# Altium project SynthyTwo.Project.PrjPcb
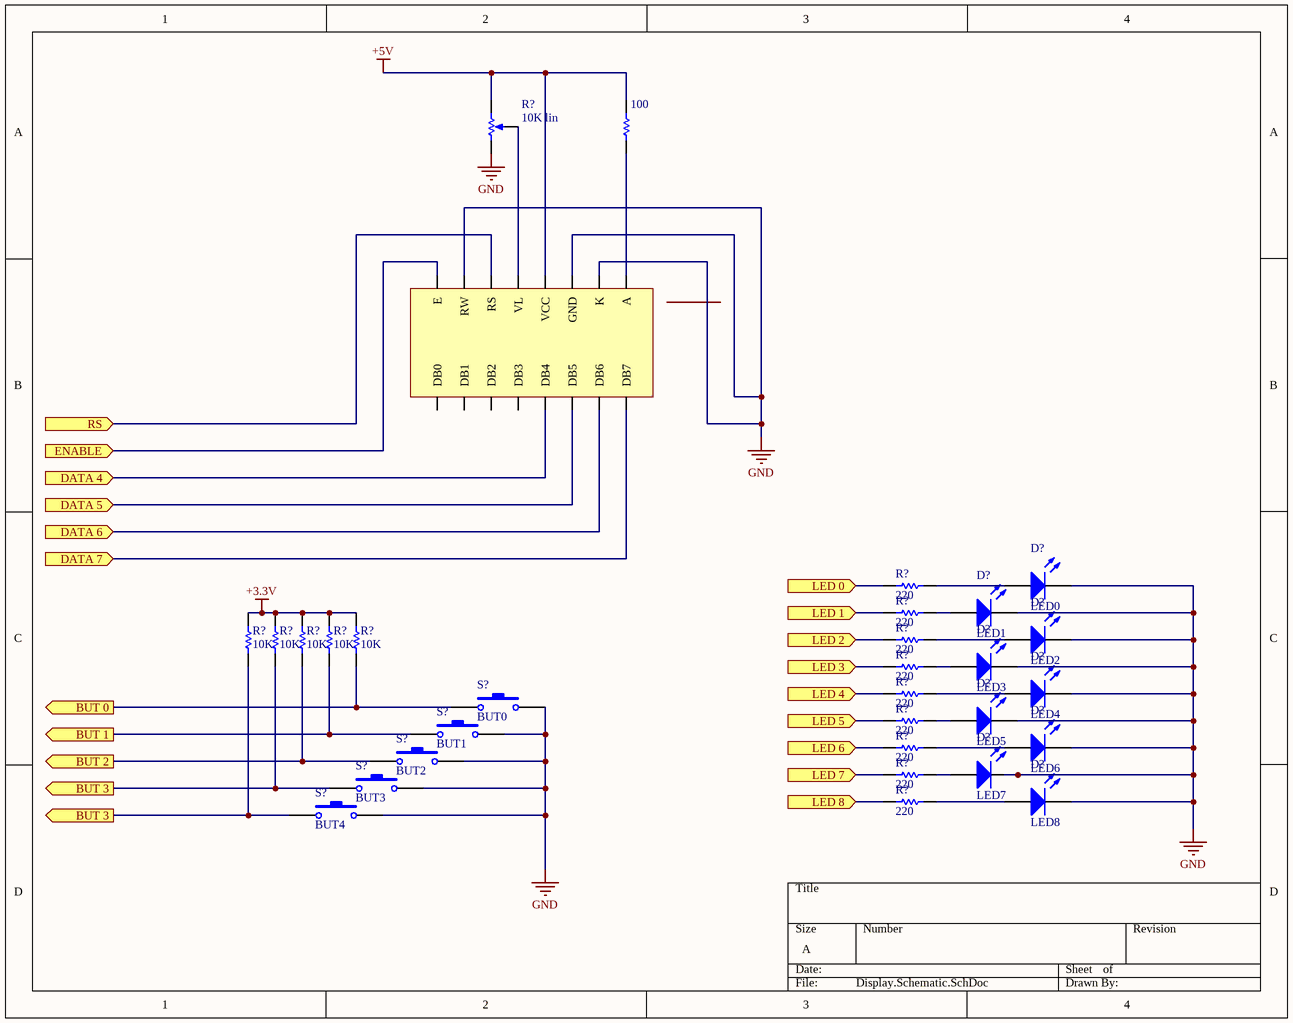
[diagram p0: Display.Schematic.SchDoc]
6 sheets, 156 parts. Net scope: flat (ports and power ports of the same name join across sheets).
Sheets:
  Display.Schematic.SchDoc
  FilterBoard.Schematic.SchDoc
  PSU.Schematic.SchDoc
  PIC.Schematic.SchDoc
  DAC.Schematic.SchDoc
  MIDI.Schematic.SchDoc

## Sheet Display.Schematic.SchDoc
size A

### Parts
(Parts that share a designator on the sheet are numbered #1, #2 ... from top to bottom, then left to right.)
*  16x2 LCD  (value not drawn)
D?#1  LED0  [LED-0]
D?#2  LED1  [LED-0]
D?#3  LED2  [LED-0]
D?#4  LED3  [LED-0]
D?#5  LED4  [LED-0]
D?#6  LED5  [LED-0]
D?#7  LED6  [LED-0]
D?#8  LED7  [LED-0]
D?#9  LED8  [LED-0]
R?#1  10K lin  [VR5]
R?#2  100  [AXIAL-0.3]
R?#3  220  [AXIAL-0.3]
R?#4  220  [AXIAL-0.3]
R?#5  220  [AXIAL-0.3]
R?#6  10K  [AXIAL-0.3]
R?#7  10K  [AXIAL-0.3]
R?#8  10K  [AXIAL-0.3]
R?#9  10K  [AXIAL-0.3]
R?#10  10K  [AXIAL-0.3]
R?#11  220  [AXIAL-0.3]
R?#12  220  [AXIAL-0.3]
R?#13  220  [AXIAL-0.3]
R?#14  220  [AXIAL-0.3]
R?#15  220  [AXIAL-0.3]
R?#16  220  [AXIAL-0.3]
S?#1  BUT0  [SPST-2]
S?#2  BUT1  [SPST-2]
S?#3  BUT2  [SPST-2]
S?#4  BUT3  [SPST-2]
S?#5  BUT4  [SPST-2]

### Ports
BUT 0 (out), BUT 1 (out), BUT 2 (out), BUT 3 (out), DATA 4 (in), DATA 5 (in), DATA 6 (in), DATA 7 (in), ENABLE (in), LED 0 (in), LED 1 (in), LED 2 (in), LED 3 (in), LED 4 (in), LED 5 (in), LED 6 (in), LED 7 (in), LED 8 (in), RS (in)

### Nets
+3.3V: R?#6.2 R?#7.2 R?#8.2 R?#9.2 R?#10.2
+5V: *.2(VCC) R?#1.2(BOT) R?#2.2
GND: *.1(GND) *.5(RW) *.16(K) D?#1.2(K) D?#2.2(K) D?#3.2(K) D?#4.2(K) D?#5.2(K) D?#6.2(K) D?#7.2(K) D?#8.2(K) D?#9.2(K) R?#1.1(TOP) S?#1.2 S?#2.2 S?#3.2 S?#4.2 S?#5.2
Net*_3: *.3(VL) R?#1.3(TAP)
Net*_4: *.4(RS) ; port RS
Net*_6: *.6(E) ; port ENABLE
Net*_7: *.7(DB7) ; port DATA 7
Net*_8: *.8(DB6) ; port DATA 6
Net*_9: *.9(DB5) ; port DATA 5
Net*_10: *.10(DB4) ; port DATA 4
Net*_15: *.15(A) R?#2.1
NetD?#1_1: D?#1.1(A) R?#3.2
NetD?#2_1: D?#2.1(A) R?#4.2
NetD?#3_1: D?#3.1(A) R?#5.2
NetD?#4_1: D?#4.1(A) R?#11.2
NetD?#5_1: D?#5.1(A) R?#12.2
NetD?#6_1: D?#6.1(A) R?#13.2
NetD?#7_1: D?#7.1(A) R?#14.2
NetD?#8_1: D?#8.1(A) R?#15.2
NetD?#9_1: D?#9.1(A) R?#16.2
NetR?#3_1: R?#3.1 ; port LED 0
NetR?#4_1: R?#4.1 ; port LED 1
NetR?#5_1: R?#5.1 ; port LED 2
NetR?#6_1: R?#6.1 R?#7.1 S?#4.1 S?#5.1 ; port BUT 3
NetR?#8_1: R?#8.1 S?#3.1 ; port BUT 2
NetR?#9_1: R?#9.1 S?#2.1 ; port BUT 1
NetR?#10_1: R?#10.1 S?#1.1 ; port BUT 0
NetR?#11_1: R?#11.1 ; port LED 3
NetR?#12_1: R?#12.1 ; port LED 4
NetR?#13_1: R?#13.1 ; port LED 5
NetR?#14_1: R?#14.1 ; port LED 6
NetR?#15_1: R?#15.1 ; port LED 7
NetR?#16_1: R?#16.1 ; port LED 8

Not connected (* = marked no-connect by the designer): * 11(DB3) 12(DB2) 13(DB1) 14(DB0)

### Library data of the parts
* = Display
D?#1-D?#9 = LED0: Typical INFRARED GaAs LED; Published: 8-Jun-2000; LatestRevisionDate: 08-Jul-2005; LatestRevisionNote: Mech Layer 1 removed.; PackageReference: LED-0; Publisher: Altium Limited; PackageDescription: LED; 2 Leads
R?#1 = RPot: Potentiometer; Sim Note: Enter the Resistance value and the set point into parameter fields.; Set Position: 0.5; Published: 8-Jun-2000; LatestRevisionDate: 17-Jul-2002; LatestRevisionNote: Re-released for DXP Platform.; PackageReference: VR5; Publisher: Altium Limited; PackageDescription: Variable Resistor, Thru-Hole; 3 Leads; Value: 10K
R?#2-R?#4 R?#6-R?#10 = Res1: Resistor; Value: 1K; Published: 8-Jun-2000; LatestRevisionDate: 17-Jul-2002; LatestRevisionNote: Re-released for DXP Platform.; PackageReference: AXIAL-0.3; Publisher: Altium Limited; PackageDescription: Axial Device, Thru-Hole; 2 Leads; 0.3 in Pin Spacing
R?#5 R?#11-R?#16 = Res1: Resistor; Published: 8-Jun-2000; LatestRevisionDate: 17-Jul-2002; LatestRevisionNote: Re-released for DXP Platform.; PackageReference: AXIAL-0.3; Publisher: Altium Limited; PackageDescription: Axial Device, Thru-Hole; 2 Leads; 0.3 in Pin Spacing; Value: 220
S?#1-S?#5 = SW-PB: Switch; Published: 24-Mar-1999; LatestRevisionDate: 17-Jul-2002; LatestRevisionNote: Re-released for DXP Platform.; PackageReference: SPST-2; Publisher: Altium Limited; PackageDescription: Switch; 2 Leads

## Sheet FilterBoard.Schematic.SchDoc
size B
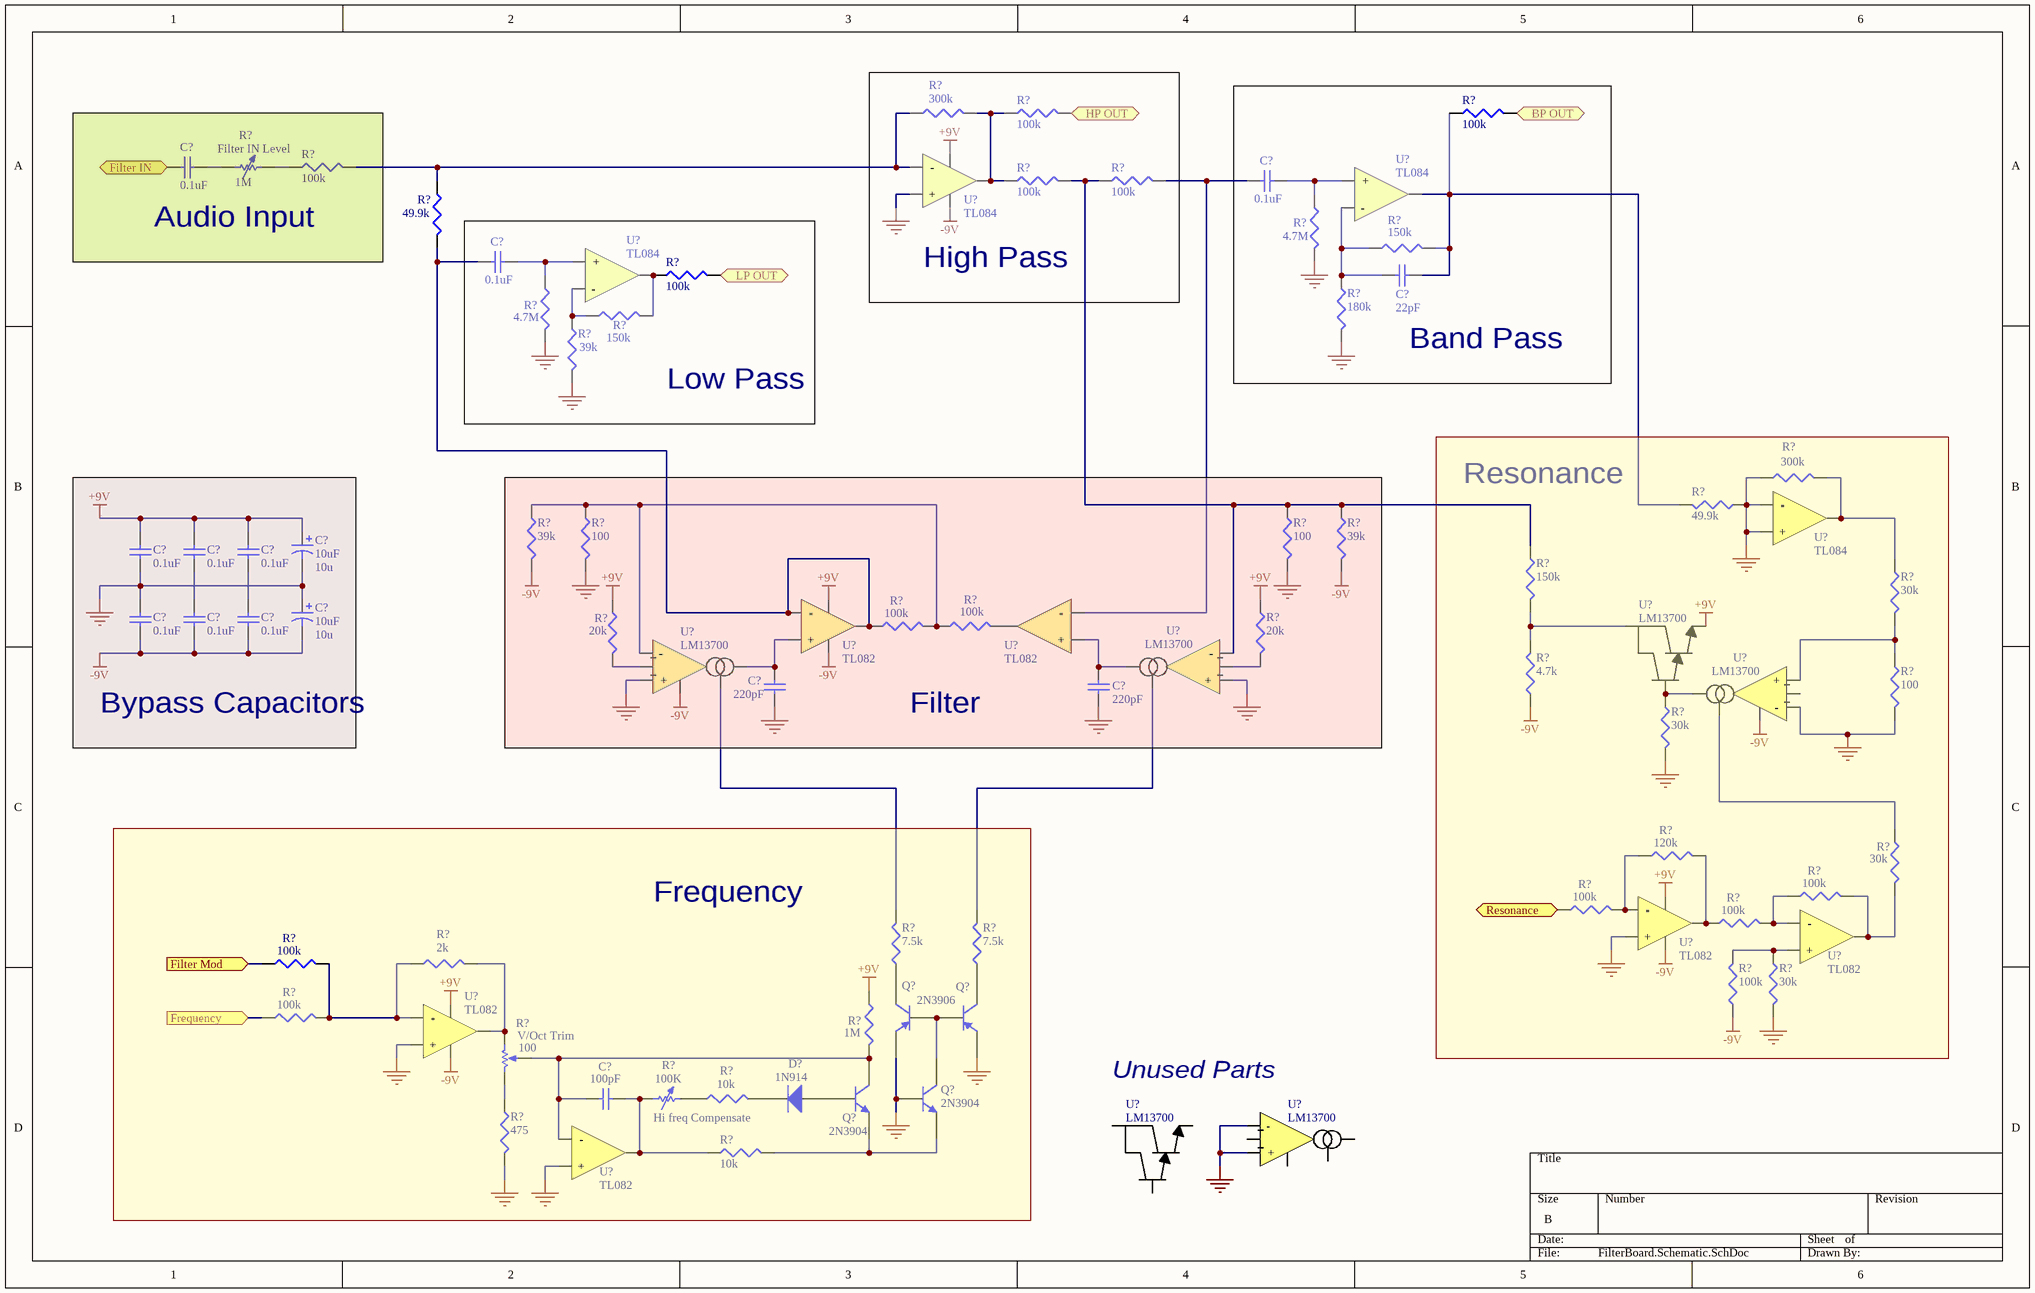
[diagram p1: FilterBoard.Schematic.SchDoc]

### Parts
(Parts that share a designator on the sheet are numbered #1, #2 ... from top to bottom, then left to right.)
C?#1  0.1uF  [C1206]
C?#2  0.1uF  [C1206]
C?#3  0.1uF  [C1206]
C?#4  22pF  [C1206]
C?#5  10uF  value 10u  [RB7.6-15]
C?#6  0.1uF  [C1206]
C?#7  0.1uF  [C1206]
C?#8  0.1uF  [C1206]
C?#9  10uF  value 10u  [RB7.6-15]
C?#10  0.1uF  [C1206]
C?#11  0.1uF  [C1206]
C?#12  0.1uF  [C1206]
C?#13  220pF  [C1206]
C?#14  220pF  [C1206]
C?#15  100pF  [C1206]
D?#10  1N914  [DO-41]
Q?#1  2N3906  [TO-92A]
Q?#2  2N3906  [TO-92A]  (value not drawn)
Q?#3  2N3904  [TO-92A]
Q?#4  2N3904  [TO-92A]
R?#17  300k  [J1-0603]
R?#18  100k  [J1-0603]
R?#19  100k  [J1-0603]
R?#20  Filter IN Level  value 1M  [AXIAL-0.7]
R?#21  100k  [J1-0603]
R?#22  100k  [J1-0603]
R?#23  100k  [J1-0603]
R?#24  49.9k  [J1-0603]
R?#25  4.7M  [J1-0603]
R?#26  150k  [J1-0603]
R?#27  100k  [J1-0603]
R?#28  4.7M  [J1-0603]
R?#29  180k  [J1-0603]
R?#30  150k  [J1-0603]
R?#31  39k  [J1-0603]
R?#32  300k  [J1-0603]
R?#33  39k  [J1-0603]
R?#34  100  [J1-0603]
R?#35  100  [J1-0603]
R?#36  39k  [J1-0603]
R?#37  49.9k  [J1-0603]
R?#38  150k  [J1-0603]
R?#39  30k  [J1-0603]
R?#40  20k  [J1-0603]
R?#41  100k  [J1-0603]
R?#42  100k  [J1-0603]
R?#43  20k  [J1-0603]
R?#44  100  [J1-0603]
R?#45  4.7k  [J1-0603]
R?#46  30k  [J1-0603]
R?#47  120k  [J1-0603]
R?#48  30k  [J1-0603]
R?#49  100k  [J1-0603]
R?#50  100k  [J1-0603]
R?#51  100k  [J1-0603]
R?#52  100k  [J1-0603]
R?#53  2k  [J1-0603]
R?#54  7.5k  [J1-0603]
R?#55  7.5k  [J1-0603]
R?#56  30k  [J1-0603]
R?#57  100k  [J1-0603]
R?#58  1M  [J1-0603]
R?#59  100k  [J1-0603]
R?#60  V/Oct Trim  value 100  [VR5]
R?#61  Hi freq Compensate  value 100K  [AXIAL-0.7]
R?#62  10k  [J1-0603]
R?#63  475  [J1-0603]
R?#64  10k  [J1-0603]
U?#1  TL084
U?#2  TL084
U?#3  TL084
U?#4  TL084
U?#5  TL082
U?#6  TL082
U?#7  LM13700
U?#8  LM13700
U?#9  LM13700
U?#10  LM13700
U?#11  TL082
U?#12  TL082
U?#13  TL082
U?#14  LM13700
U?#15  TL082
U?#16  LM13700

### Blocks framed on the sheet
Audio Input: C?#1 R?#20 R?#21
High Pass: R?#17 R?#18 R?#22 R?#23 U?#1
Band Pass: C?#2 C?#4 R?#19 R?#25 R?#26 R?#29 U?#2
Low Pass: C?#3 R?#27 R?#28 R?#30 R?#31 U?#3
Resonance: R?#32 R?#37-R?#39 R?#44-R?#51 R?#56 R?#59 U?#4 U?#9-U?#12
Bypass Capacitors: C?#5-C?#12
Filter: C?#13 C?#14 R?#33-R?#36 R?#40-R?#43 U?#5-U?#8
Frequency: C?#15 D?#10 Q?#1-Q?#4 R?#52-R?#55 R?#57 R?#58 R?#60-R?#64 U?#13 U?#15

### Ports
BP OUT (out), Filter IN (in), Filter Mod (in), Frequency (in), HP OUT (out), LP OUT (out), Resonance (in)

### Nets
+9V: C?#5.1 C?#6.2 C?#7.2 C?#8.2 R?#40.1 R?#43.1 R?#58.1 U?#1.4(VCC+) U?#5.8(VCC+) U?#9.8(BOUT) U?#11.8(VCC+) U?#13.8(VCC+)
-9V: C?#9.2 C?#10.1 C?#11.1 C?#12.1 R?#33.2 R?#36.2 R?#45.1 R?#59.1 U?#1.11(VCC-) U?#5.4(VCC-) U?#7.6(VCC-) U?#10.6(VCC-) U?#11.4(VCC-) U?#13.4(VCC-)
GND: C?#5.2 C?#6.1 C?#9.1 C?#10.2 C?#13.1 C?#14.1 Q?#1.1(E) Q?#2.1(E) Q?#4.2(B) R?#25.2 R?#28.2 R?#29.2 R?#31.2 R?#32.1 R?#34.2 R?#35.2 R?#37.1 R?#44.2 R?#46.2 R?#56.2 R?#63.2 U?#1.3(+) U?#4.12(-) U?#4.13(+) U?#7.3(+) U?#8.3(+) U?#10.3(-) U?#11.3(+) U?#13.3(+) U?#14.3(+) U?#14.4(-) U?#15.5(+)
NetC?#1_1: C?#1.1 ; port Filter IN
NetC?#1_2: C?#1.2 R?#20.1
NetC?#2_1: C?#2.1 R?#23.2 U?#6.6(-)
NetC?#2_2: C?#2.2 R?#25.1 U?#2.5(+)
NetC?#3_1: C?#3.1 R?#24.2 R?#41.1 U?#5.1(OUT) U?#5.2(-)
NetC?#3_2: C?#3.2 R?#28.1 U?#3.5(+)
NetC?#4_1: C?#4.1 R?#26.1 R?#29.1 U?#2.3(-)
NetC?#4_2: C?#4.2 R?#19.1 R?#26.2 R?#37.2 U?#2.7(OUT)
NetC?#7_1: C?#7.1 C?#11.2
NetC?#8_1: C?#8.1 C?#12.2
NetC?#13_2: C?#13.2 U?#5.3(+) U?#7.5(OUT)
NetC?#14_2: C?#14.2 U?#6.5(+) U?#8.5(OUT)
NetC?#15_1: C?#15.1 Q?#3.3(C) R?#58.2 R?#60.3(TAP) U?#15.6(-)
NetC?#15_2: C?#15.2 R?#61.1 R?#64.1 U?#15.7(OUT)
NetD?#10_1: D?#10.1(A) Q?#3.2(B)
NetD?#10_2: D?#10.2(K) R?#62.2
NetQ?#1_2: Q?#1.2(B) Q?#2.2(B) Q?#4.3(C)
NetQ?#1_3: Q?#1.3(C) R?#54.1
NetQ?#2_3: Q?#2.3(C) R?#55.1
NetQ?#3_1: Q?#3.1(E) Q?#4.1(E) R?#64.2
NetR?#17_1: R?#17.1 R?#21.2 R?#24.1 U?#1.2(-)
NetR?#17_2: R?#17.2 R?#18.1 R?#22.1 U?#1.1(OUT)
NetR?#18_2: R?#18.2 ; port HP OUT
NetR?#19_2: R?#19.2 ; port BP OUT
NetR?#20_2: R?#20.2 R?#21.1
NetR?#22_2: R?#22.2 R?#23.1 R?#35.1 R?#36.1 R?#38.1 U?#8.4(-)
NetR?#27_1: R?#27.1 R?#30.2 U?#3.7(OUT)
NetR?#27_2: R?#27.2 ; port LP OUT
NetR?#30_1: R?#30.1 R?#31.1 U?#3.3(-)
NetR?#32_2: R?#32.2 R?#39.1 U?#4.14(OUT)
NetR?#33_1: R?#33.1 R?#34.1 R?#41.2 R?#42.1 U?#7.4(-)
NetR?#38_2: R?#38.2 R?#45.2 U?#9.11(V+)
NetR?#39_2: R?#39.2 R?#44.1 U?#10.4(+)
NetR?#40_2: R?#40.2 U?#7.2
NetR?#42_2: R?#42.2 U?#6.7(OUT)
NetR?#43_2: R?#43.2 U?#8.2
NetR?#46_1: R?#46.1 U?#9.7(BIN) U?#10.5(OUT)
NetR?#47_1: R?#47.1 R?#50.2 U?#11.2(-)
NetR?#47_2: R?#47.2 R?#51.1 U?#11.1(OUT)
NetR?#48_1: R?#48.1 U?#10.1(BIAS)
NetR?#48_2: R?#48.2 R?#49.2 U?#12.7(OUT)
NetR?#49_1: R?#49.1 R?#51.2 U?#12.6(-)
NetR?#50_1: R?#50.1 ; port Resonance
NetR?#52_1: R?#52.1 ; port Filter Mod
NetR?#52_2: R?#52.2 R?#53.1 R?#57.2 U?#13.2(-)
NetR?#53_2: R?#53.2 R?#60.1(TOP) U?#13.1(OUT)
NetR?#54_2: R?#54.2 U?#7.1(BIAS)
NetR?#55_2: R?#55.2 U?#8.1(BIAS)
NetR?#56_1: R?#56.1 R?#59.2 U?#12.5(+)
NetR?#57_1: R?#57.1 ; port Frequency
NetR?#60_2: R?#60.2(BOT) R?#63.1
NetR?#61_2: R?#61.2 R?#62.1

Not connected (* = marked no-connect by the designer): U?#2 6(VCC+) 11(VCC-); U?#3 6(VCC+) 11(VCC-); U?#4 1(VCC+) 11(VCC-); U?#6 4(VCC-) 8(VCC+); U?#8 6(VCC-); U?#10 2; U?#12 4(VCC-) 8(VCC+); U?#14 1(BIAS) 2 5(OUT) 6(VCC-); U?#15 4(VCC-) 8(VCC+); U?#16 7(BIN) 8(BOUT) 11(V+)

### Notes on the sheet
- (near U?#16) Unused Parts

### Library data of the parts
C?#1-C?#3 C?#6-C?#8 C?#10-C?#12 = Cap Semi: Capacitor (Semiconductor SIM Model); Value: 0.1u; Published: 8-Jun-2000; LatestRevisionDate: 29-May-2009; LatestRevisionNote: IPC-7351 Footprint Added.; PackageReference: C1206; Publisher: Altium Limited; PackageDescription: Chip Capacitor
C?#4 = Cap Semi: Capacitor (Semiconductor SIM Model); Value: 22p; Published: 8-Jun-2000; LatestRevisionDate: 29-May-2009; LatestRevisionNote: IPC-7351 Footprint Added.; PackageReference: C1206; Publisher: Altium Limited; PackageDescription: Chip Capacitor
C?#5 C?#9 = Cap Pol1: Polarized Capacitor (Radial); Published: 8-Jun-2000; LatestRevisionDate: 17-Jul-2002; LatestRevisionNote: Re-released for DXP Platform.; PackageReference: RB7.6-15; Publisher: Altium Limited; PackageDescription: Polarized Capacitor (Radial); 2 Leads
C?#13 C?#14 = Cap Semi: Capacitor (Semiconductor SIM Model); Value: 220p; Published: 8-Jun-2000; LatestRevisionDate: 29-May-2009; LatestRevisionNote: IPC-7351 Footprint Added.; PackageReference: C1206; Publisher: Altium Limited; PackageDescription: Chip Capacitor
C?#15 = Cap Semi: Capacitor (Semiconductor SIM Model); Value: 100p; Published: 8-Jun-2000; LatestRevisionDate: 29-May-2009; LatestRevisionNote: IPC-7351 Footprint Added.; PackageReference: C1206; Publisher: Altium Limited; PackageDescription: Chip Capacitor
D?#10 = Diode 1N4001: 1 Amp General Purpose Rectifier; Published: 8-Jun-2000; LatestRevisionDate: 17-Jul-2002; LatestRevisionNote: Re-released for DXP Platform.; DatasheetVersion: 1998; PackageVersion: Aug-1999; PackageReference: DO-41; Publisher: Altium Limited; PackageDescription: Diode, Axial; Body 5.2 x 2.7 mm (LxDia. max), Lead Dia. 0.86 mm (max); Code_JEDEC: DO-204-AL; ComponentLink1Description: Manufacturer Link; ComponentLink1URL: http://www.fairchildsemi.com/; ComponentLink2Description: Datasheet; ComponentLink2URL: http://www.fairchildsemi.com/ds/1N%2F1N4001.pdf
Q?#1 Q?#2 = 2N3906: PNP General Purpose Amplifier; Published: 8-Jun-2000; LatestRevisionDate: 15-Jan-2003; LatestRevisionNote: PCB Footprint 'BCY-W3/D4.7' replaced; DatasheetVersion: 1997; PackageVersion: Sep-1998; PackageReference: TO-92A; Publisher: Altium Limited; PackageDescription: TO, Flat Index; 3 In-Line, Axial Leads; Body Dia. 4.5mm; Leads 0.51 x 0.48 mm (max); ComponentLink1Description: Manufacturer Link; ComponentLink1URL: http://www.fairchildsemi.com/; ComponentLink2Description: Datasheet; ComponentLink2URL: http://www.fairchildsemi.com/ds/2N%2F2N3906.pdf
Q?#3 Q?#4 = 2N3904: NPN General Purpose Amplifier; Published: 8-Jun-2000; LatestRevisionDate: 15-Jan-2003; LatestRevisionNote: PCB Footprint 'BCY-W3/D4.7' replaced; DatasheetVersion: 1997; PackageVersion: Sep-1998; PackageReference: TO-92A; Publisher: Altium Limited; PackageDescription: TO, Flat Index; 3 In-Line, Axial Leads; Body Dia. 4.5mm; Leads 0.51 x 0.48 mm (max); ComponentLink1Description: Manufacturer Link; ComponentLink1URL: http://www.fairchildsemi.com/; ComponentLink2Description: Datasheet; ComponentLink2URL: http://www.fairchildsemi.com/ds/2N%2F2N3904.pdf
R?#17-R?#19 R?#21-R?#59 R?#62-R?#64 = Res3: Resistor; Published: 8-Jun-2000; LatestRevisionDate: 29-May-2009; LatestRevisionNote: IPC-7351 Footprint Added.; PackageReference: J1-0603; Publisher: Altium Limited; PackageDescription: Chip Resistor
  R?#17 R?#32: Value: 300K
  R?#18 R?#19 R?#21-R?#23 R?#27 R?#41 R?#42 R?#49-R?#52 R?#57 R?#59: Value: 100K
  R?#24 R?#37: Value: 49.9K
  R?#25 R?#28: Value: 4.7M
  R?#26 R?#30 R?#38: Value: 150K
  R?#29: Value: 180K
  R?#31 R?#33 R?#36: Value: 39K
  R?#34 R?#35 R?#44: Value: 100
  R?#39 R?#46 R?#48 R?#56: Value: 30K
  R?#40 R?#43: Value: 20K
  R?#45: Value: 4.7K
  R?#47: Value: 120K
  R?#53: Value: 2K
  R?#54 R?#55: Value: 7.5K
  R?#58: Value: 1M
  R?#62 R?#64: Value: 10K
  R?#63: Value: 475
R?#20 R?#61 = Res Adj1: Variable Resistor; Set Position: 0.5; Published: 8-Jun-2000; LatestRevisionDate: 17-Jul-2002; LatestRevisionNote: Re-released for DXP Platform.; PackageReference: AXIAL-0.7; Publisher: Altium Limited; PackageDescription: Axial Device, Thru-Hole; 2 Leads; 0.7 in Pin Spacing
R?#60 = RPot: as R?#1 on sheet Display.Schematic; Published: 8-Jun-2000; LatestRevisionDate: 17-Jul-2002; LatestRevisionNote: Re-released for DXP Platform.; PackageReference: VR5; Publisher: Altium Limited; PackageDescription: Variable Resistor, Thru-Hole; 3 Leads
U?#9 U?#16 = LM13700_1

## Sheet PSU.Schematic.SchDoc
size A
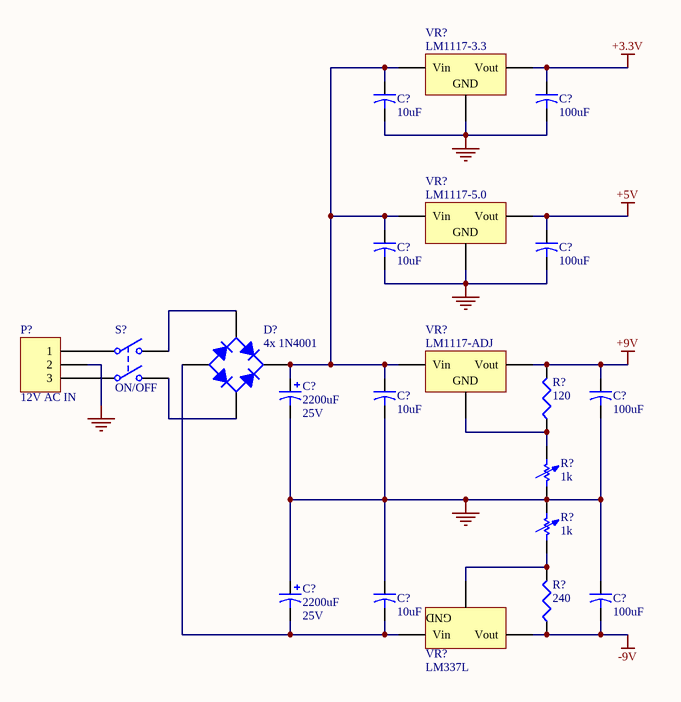
[diagram p2: PSU.Schematic.SchDoc]

### Parts
(Parts that share a designator on the sheet are numbered #1, #2 ... from top to bottom, then left to right.)
C?#16  10uF  [CAPR5-4X5]
C?#17  100uF  [CAPR5-4X5]
C?#18  10uF  [CAPR5-4X5]
C?#19  100uF  [CAPR5-4X5]
C?#20  2200uF  value 25V  [RB7.6-15]
C?#21  10uF  [CAPR5-4X5]
C?#22  100uF  [CAPR5-4X5]
C?#23  2200uF  value 25V  [RB7.6-15]
C?#24  10uF  [CAPR5-4X5]
C?#25  100uF  [CAPR5-4X5]
D?#11  4x 1N4001  [D-38]
P?  12V AC IN  [HDR1X3]
R?#65  120  [J1-0603]
R?#66  1k  [AXIAL-0.7]
R?#67  1k  [AXIAL-0.7]
R?#68  240  [J1-0603]
S?#6  ON/OFF  [DPST-4]
VR?#1  LM1117-3.3  [D2PAK_N]
VR?#2  LM1117-5.0  [D2PAK_N]
VR?#3  LM1117-ADJ  [D2PAK_N]
VR?#4  LM337L  [D2PAK_N]

### Nets
+3.3V: C?#17.1 VR?#1.3(Vout)
+5V: C?#19.1 VR?#2.3(Vout)
+9V: C?#22.1 R?#65.2 VR?#3.3(Vout)
-9V: C?#25.2 R?#68.1 VR?#4.3(Vout)
GND: C?#16.2 C?#17.2 C?#18.2 C?#19.2 C?#20.2 C?#21.2 C?#22.2 C?#23.1 C?#24.1 C?#25.1 P?.2 R?#66.1 R?#67.2 VR?#1.2(GND) VR?#2.2(GND)
NetC?#16_1: C?#16.1 C?#18.1 C?#20.1 C?#21.1 D?#11.1(K) VR?#1.1(Vin) VR?#2.1(Vin) VR?#3.1(Vin)
NetC?#23_2: C?#23.2 C?#24.2 D?#11.3(A) VR?#4.1(Vin)
NetD?#11_2: D?#11.2(C) S?#6.4(NO2)
NetD?#11_4: D?#11.4(C) S?#6.2(NO1)
NetP?_1: P?.1 S?#6.1(COMMON1)
NetP?_3: P?.3 S?#6.3(COMMON2)
NetR?#65_1: R?#65.1 R?#66.2 VR?#3.2(ADJ)
NetR?#67_1: R?#67.1 R?#68.2 VR?#4.2(ADJ)

### Notes on the sheet
- (in symbol Volt Reg) GND

### Library data of the parts
C?#16 C?#18 C?#21 C?#24 = Cap2: Capacitor; Value: 10u; Published: 23-Sep-2002; PackageReference: CAPR5-4X5; Publisher: Altium Limited; PackageDescription: Capacitor; 2 Leads
C?#17 C?#19 C?#22 C?#25 = Cap2: Capacitor; Value: 100u; Published: 23-Sep-2002; PackageReference: CAPR5-4X5; Publisher: Altium Limited; PackageDescription: Capacitor; 2 Leads
C?#20 C?#23 = Cap Pol1: Polarized Capacitor (Radial); Published: 8-Jun-2000; LatestRevisionDate: 17-Jul-2002; LatestRevisionNote: Re-released for DXP Platform.; PackageReference: RB7.6-15; Publisher: Altium Limited; PackageDescription: Polarized Capacitor (Radial); 2 Leads
D?#11 = Bridge1: Full Wave Diode Bridge; Published: 8-Jun-2000; LatestRevisionDate: 29-May-2009; LatestRevisionNote: Sch pins A & K swapped.; DatasheetVersion: E2732B; PackageReference: D-38; Publisher: Altium Limited; PackageDescription: Bridge Rectifier; 4 Terminals; Body 9.4 x 9.4 mm (typ); Pitch 5.08 mm
P? = Header 3: Header, 3-Pin; LatestRevisionDate: 17-Jul-2002; LatestRevisionNote: Re-released for DXP Platform.; Publisher: Altium Limited
R?#65 R?#68 = Res3: Resistor; Published: 8-Jun-2000; LatestRevisionDate: 29-May-2009; LatestRevisionNote: IPC-7351 Footprint Added.; PackageReference: J1-0603; Publisher: Altium Limited; PackageDescription: Chip Resistor
  R?#65: Value: 120
  R?#68: Value: 240
R?#66 R?#67 = Res Adj1: Variable Resistor; Set Position: 0.5; Published: 8-Jun-2000; LatestRevisionDate: 17-Jul-2002; LatestRevisionNote: Re-released for DXP Platform.; PackageReference: AXIAL-0.7; Publisher: Altium Limited; PackageDescription: Axial Device, Thru-Hole; 2 Leads; 0.7 in Pin Spacing; Value: 1K
S?#6 = SW-DPST: Double-Pole, Single-Throw Switch; Published: 24-Mar-1999; LatestRevisionDate: 17-Jul-2002; LatestRevisionNote: Re-released for DXP Platform.; PackageReference: DPST-4; Publisher: Altium Limited; PackageDescription: Switch; 4 Leads
VR?#1-VR?#4 = Volt Reg: Voltage Regulator; Published: 24-Mar-1999; LatestRevisionDate: 29-May-2009; LatestRevisionNote: IPC-7351 Footprint Added.; PackageReference: D2PAK; Publisher: Altium Limited; PackageDescription: 3-Pin Transistor Outline Package 2.54 mm Pitch, 15.1 mm Lead Span

## Sheet PIC.Schematic.SchDoc
size A
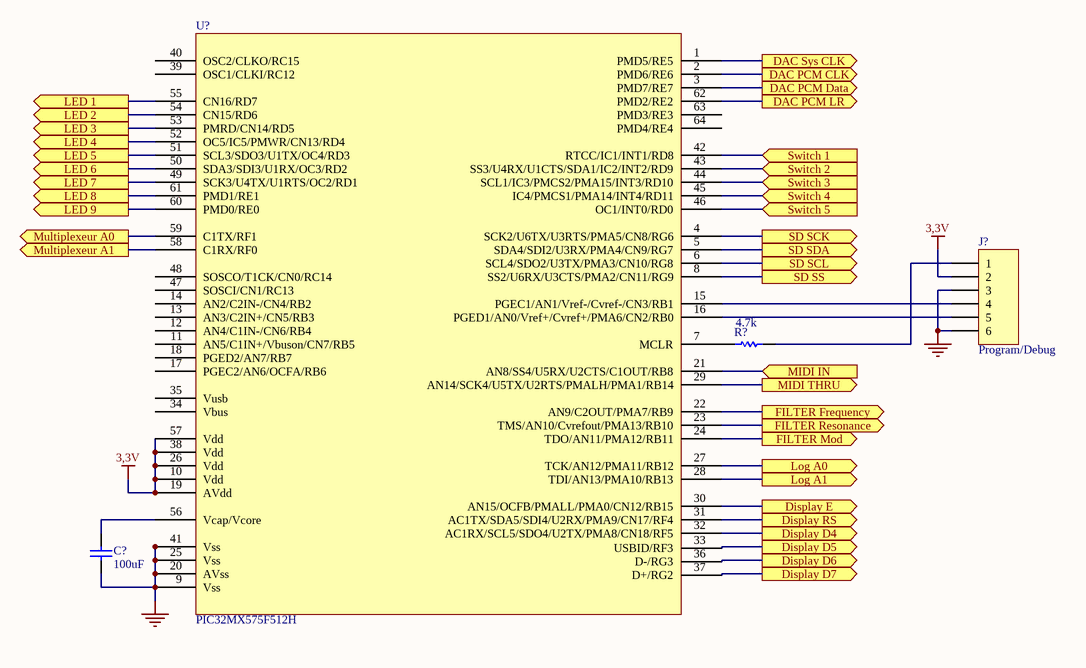
[diagram p3: PIC.Schematic.SchDoc]

### Parts
(Parts that share a designator on the sheet are numbered #1, #2 ... from top to bottom, then left to right.)
C?#26  value 100uF  [RAD-0.3]  (hidden comment: Cap)
J?  Program/Debug  [HDR1X6H]
R?#69  value 4.7k  [AXIAL-0.3]  (hidden comment: Res1)
U?#17  PIC32MX575F512H

### Ports
DAC PCM CLK (out), DAC PCM Data (out), DAC PCM LR (out), DAC Sys CLK (out), Display D4 (out), Display D5 (out), Display D6 (out), Display D7 (out), Display E (out), Display RS (out), FILTER Frequency (out), FILTER Mod (out), FILTER Resonance (out), LED 1 (out), LED 2 (out), LED 3 (out), LED 4 (out), LED 5 (out), LED 6 (out), LED 7 (out), LED 8 (out), LED 9 (out), Log A0 (out), Log A1 (out), MIDI IN (in), MIDI THRU (out), Multiplexeur A0 (out), Multiplexeur A1 (out), SD SCK (out), SD SCL (out), SD SDA (out), SD SS (out), Switch 1 (in), Switch 2 (in), Switch 3 (in), Switch 4 (in), Switch 5 (in)

### Nets
3,3V: J?.2 U?#17.10(Vdd) U?#17.19(AVdd) U?#17.26(Vdd) U?#17.38(Vdd) U?#17.57(Vdd)
GND: C?#26.1 J?.3 J?.6 U?#17.9(Vss) U?#17.20(AVss) U?#17.25(Vss) U?#17.41(Vss)
Net6N139_?6: U?#17.21(AN8/SS4/U5RX/U2CTS/C1OUT/RB8) ; port MIDI IN
NetC?#26_2: C?#26.2 U?#17.56(Vcap/Vcore)
NetJ?_1: J?.1 R?#69.2
NetJ?_4: J?.4 U?#17.15(PGEC1/AN1/Vref-/Cvref-/CN3/RB1)
NetJ?_5: J?.5 U?#17.16(PGED1/AN0/Vref+/Cvref+/PMA6/CN2/RB0)
NetR?#4_1: U?#17.55(CN16/RD7) ; port LED 1
NetR?#5_1: U?#17.54(CN15/RD6) ; port LED 2
NetR?#11_1: U?#17.53(PMRD/CN14/RD5) ; port LED 3
NetR?#12_1: U?#17.52(OC5/IC5/PMWR/CN13/RD4) ; port LED 4
NetR?#13_1: U?#17.51(SCL3/SDO3/U1TX/OC4/RD3) ; port LED 5
NetR?#14_1: U?#17.50(SDA3/SDI3/U1RX/OC3/RD2) ; port LED 6
NetR?#15_1: U?#17.49(SCK3/U4TX/U1RTS/OC2/RD1) ; port LED 7
NetR?#16_1: U?#17.61(PMD1/RE1) ; port LED 8
NetR?#52_1: U?#17.24(TDO/AN11/PMA12/RB11) ; port FILTER Mod
NetR?#69_1: R?#69.1 U?#17.7(MCLR)
NetU?#17_1: U?#17.1(PMD5/RE5) ; port DAC Sys CLK
NetU?#17_2: U?#17.2(PMD6/RE6) ; port DAC PCM CLK
NetU?#17_3: U?#17.3(PMD7/RE7) ; port DAC PCM Data
NetU?#17_4: U?#17.4(SCK2/U6TX/U3RTS/PMA5/CN8/RG6) ; port SD SCK
NetU?#17_5: U?#17.5(SDA4/SDI2/U3RX/PMA4/CN9/RG7) ; port SD SDA
NetU?#17_6: U?#17.6(SCL4/SDO2/U3TX/PMA3/CN10/RG8) ; port SD SCL
NetU?#17_8: U?#17.8(SS2/U6RX/U3CTS/PMA2/CN11/RG9) ; port SD SS
NetU?#17_22: U?#17.22(AN9/C2OUT/PMA7/RB9) ; port FILTER Frequency
NetU?#17_23: U?#17.23(TMS/AN10/Cvrefout/PMA13/RB10) ; port FILTER Resonance
NetU?#17_27: U?#17.27(TCK/AN12/PMA11/RB12) ; port Log A0
NetU?#17_28: U?#17.28(TDI/AN13/PMA10/RB13) ; port Log A1
NetU?#17_29: U?#17.29(AN14/SCK4/U5TX/U2RTS/PMALH/PMA1/RB14) ; port MIDI THRU
NetU?#17_30: U?#17.30(AN15/OCFB/PMALL/PMA0/CN12/RB15) ; port Display E
NetU?#17_31: U?#17.31(AC1TX/SDA5/SDI4/U2RX/PMA9/CN17/RF4) ; port Display RS
NetU?#17_32: U?#17.32(AC1RX/SCL5/SDO4/U2TX/PMA8/CN18/RF5) ; port Display D4
NetU?#17_33: U?#17.33(USBID/RF3) ; port Display D5
NetU?#17_36: U?#17.36(D-/RG3) ; port Display D6
NetU?#17_37: U?#17.37(D+/RG2) ; port Display D7
NetU?#17_42: U?#17.42(RTCC/IC1/INT1/RD8) ; port Switch 1
NetU?#17_43: U?#17.43(SS3/U4RX/U1CTS/SDA1/IC2/INT2/RD9) ; port Switch 2
NetU?#17_44: U?#17.44(SCL1/IC3/PMCS2/PMA15/INT3/RD10) ; port Switch 3
NetU?#17_45: U?#17.45(IC4/PMCS1/PMA14/INT4/RD11) ; port Switch 4
NetU?#17_46: U?#17.46(OC1/INT0/RD0) ; port Switch 5
NetU?#17_58: U?#17.58(C1RX/RF0) ; port Multiplexeur A1
NetU?#17_59: U?#17.59(C1TX/RF1) ; port Multiplexeur A0
NetU?#17_60: U?#17.60(PMD0/RE0) ; port LED 9
NetU?#17_62: U?#17.62(PMD2/RE2) ; port DAC PCM LR

Not connected (* = marked no-connect by the designer): U?#17 11(AN5/C1IN+/Vbuson/CN7/RB5) 12(AN4/C1IN-/CN6/RB4) 13(AN3/C2IN+/CN5/RB3) 14(AN2/C2IN-/CN4/RB2) 17(PGEC2/AN6/OCFA/RB6) 18(PGED2/AN7/RB7) 34(Vbus) 35(Vusb) 39(OSC1/CLKI/RC12) 40(OSC2/CLKO/RC15) 47(SOSCI/CN1/RC13) 48(SOSCO/T1CK/CN0/RC14) 63(PMD3/RE3) 64(PMD4/RE4)

### Library data of the parts
C?#26 = Cap: Capacitor; Published: 8-Jun-2000; LatestRevisionDate: 17-Jul-2002; LatestRevisionNote: Re-released for DXP Platform.; PackageReference: RAD-0.3; Publisher: Altium Limited; PackageDescription: Radial Cap, Thru-Hole; 2 Leads; 0.3 in Pin Spacing
J? = Header 6H: Header, 6-Pin, Right Angle; LatestRevisionDate: 17-Jul-2002; LatestRevisionNote: Re-released for DXP Platform.; Publisher: Altium Limited
R?#69 = Res1: Resistor; Published: 8-Jun-2000; LatestRevisionDate: 17-Jul-2002; LatestRevisionNote: Re-released for DXP Platform.; PackageReference: AXIAL-0.3; Publisher: Altium Limited; PackageDescription: Axial Device, Thru-Hole; 2 Leads; 0.3 in Pin Spacing
U?#17 = PIC32 MX575F512H

## Sheet DAC.Schematic.SchDoc
size A
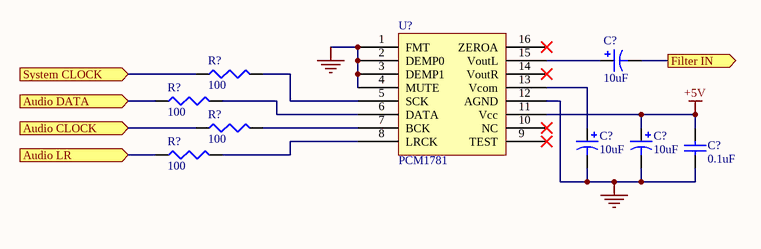
[diagram p4: DAC.Schematic.SchDoc]

### Parts
(Parts that share a designator on the sheet are numbered #1, #2 ... from top to bottom, then left to right.)
C?#27  10uF  [RB7.6-15]
C?#28  10uF  [RB7.6-15]
C?#29  10uF  [RB7.6-15]
C?#30  0.1uF  [C1206]
R?#70  100  [J1-0603]
R?#71  100  [J1-0603]
R?#72  100  [J1-0603]
R?#73  100  [J1-0603]
U?#18  PCM1781

### Ports
Audio CLOCK (in), Audio DATA (in), Audio LR (in), Filter IN (out), System CLOCK (in)

### Nets
+5V: C?#29.1 C?#30.2 U?#18.11(Vcc)
NetC?#28_2: C?#28.2 C?#29.2 C?#30.1 U?#18.1(FMT) U?#18.2(DEMP0) U?#18.3(DEMP1) U?#18.4(MUTE) U?#18.12(AGND)
NetC?#1_1: C?#27.2 ; port Filter IN
NetC?#27_1: C?#27.1 U?#18.15(VoutL)
NetC?#28_1: C?#28.1 U?#18.13(Vcom)
NetR?#70_1: R?#70.1 ; port System CLOCK
NetR?#70_2: R?#70.2 U?#18.5(SCK)
NetR?#71_1: R?#71.1 ; port Audio DATA
NetR?#71_2: R?#71.2 U?#18.6(DATA)
NetR?#72_1: R?#72.1 ; port Audio CLOCK
NetR?#72_2: R?#72.2 U?#18.7(BCK)
NetR?#73_1: R?#73.1 ; port Audio LR
NetR?#73_2: R?#73.2 U?#18.8(LRCK)

Not connected (* = marked no-connect by the designer): U?#18 9(TEST)* 10(NC)* 14(VoutR)* 16(ZEROA)*

### Library data of the parts
C?#27-C?#29 = Cap Pol1: Polarized Capacitor (Radial); Published: 8-Jun-2000; LatestRevisionDate: 17-Jul-2002; LatestRevisionNote: Re-released for DXP Platform.; PackageReference: RB7.6-15; Publisher: Altium Limited; PackageDescription: Polarized Capacitor (Radial); 2 Leads; Value: 10uF
C?#30 = Cap Semi: as C?#1 on sheet FilterBoard.Schematic; Published: 8-Jun-2000; LatestRevisionDate: 29-May-2009; LatestRevisionNote: IPC-7351 Footprint Added.; PackageReference: C1206; Publisher: Altium Limited; PackageDescription: Chip Capacitor
R?#70-R?#73 = Res3: Resistor; Published: 8-Jun-2000; LatestRevisionDate: 29-May-2009; LatestRevisionNote: IPC-7351 Footprint Added.; PackageReference: J1-0603; Publisher: Altium Limited; PackageDescription: Chip Resistor; Value: 100
U?#18 = PCM1781 DAC

## Sheet MIDI.Schematic.SchDoc
size A
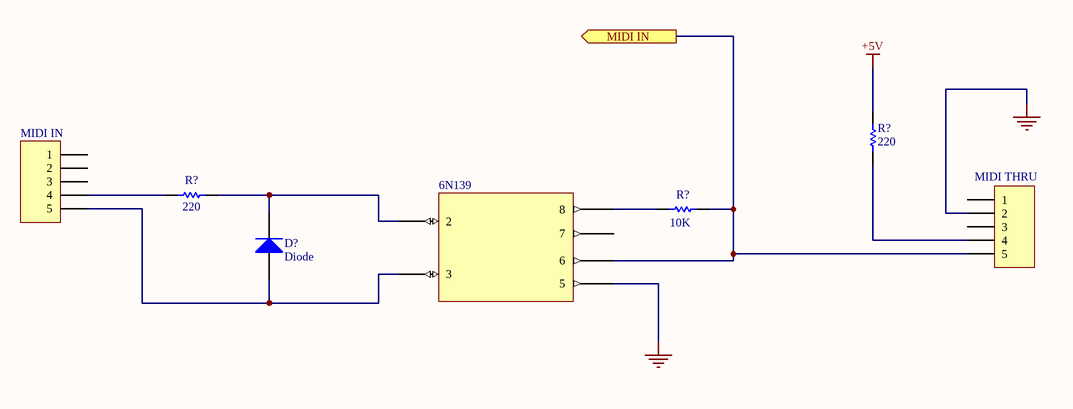
[diagram p5: MIDI.Schematic.SchDoc]

### Parts
(Parts that share a designator on the sheet are numbered #1, #2 ... from top to bottom, then left to right.)
6N139  6N139  (value not drawn)
D?#12  Diode  [SMC]
MIDI_IN  Header 5  [HDR1X5]  (value not drawn)
MIDI_THRU  Header 5  [HDR1X5]  (value not drawn)
R?#74  value 220  [AXIAL-0.3]  (hidden comment: Res1)
R?#75  value 220  [AXIAL-0.3]  (hidden comment: Res1)
R?#76  value 10K  [AXIAL-0.3]  (hidden comment: Res1)

### Ports
MIDI IN (out)

### Nets
+5V: R?#74.2
GND: 6N139.?4(5) MIDI_THRU.2
Net6N139_?1: 6N139.?1(3) D?#12.1(A) MIDI_IN.5
Net6N139_?2: 6N139.?2(2) D?#12.2(K) R?#75.2
Net6N139_?3: 6N139.?3(8) R?#76.1
Net6N139_?6: 6N139.?6(6) MIDI_THRU.5 R?#76.2 ; port MIDI IN
NetMIDI_IN_4: MIDI_IN.4 R?#75.1
NetMIDI_THRU_4: MIDI_THRU.4 R?#74.1

Not connected (* = marked no-connect by the designer): 6N139 ?5(7); MIDI_IN 1 2 3; MIDI_THRU 1 3

### Library data of the parts
D?#12 = Diode: Default Diode; Published: 8-Jun-2000; LatestRevisionDate: 17-Jul-2002; LatestRevisionNote: Re-released for DXP Platform.; PackageVersion: Sep-1996; PackageReference: SMC; Publisher: Altium Limited; PackageDescription: DO-214-AB/SMC; 2 C-Bend Leads; Body 7.9 x 5.9 mm, inc. leads (LxW); Code_JEDEC: DO-214-AB
MIDI_IN MIDI_THRU = Header 5: DIN 5 Pins; LatestRevisionDate: 17-Jul-2002; LatestRevisionNote: Re-released for DXP Platform.; Publisher: Altium Limited
R?#74-R?#76 = Res1: Resistor; Published: 8-Jun-2000; LatestRevisionDate: 17-Jul-2002; LatestRevisionNote: Re-released for DXP Platform.; PackageReference: AXIAL-0.3; Publisher: Altium Limited; PackageDescription: Axial Device, Thru-Hole; 2 Leads; 0.3 in Pin Spacing

## Nets that join several sheets
+3.3V: Display.Schematic (5 pins), PSU.Schematic (C?#17.1 VR?#1.3)
+5V: Display.Schematic (*.2 R?#1.2 R?#2.2), PSU.Schematic (C?#19.1 VR?#2.3), DAC.Schematic (C?#29.1 C?#30.2 U?#18.11), MIDI.Schematic (R?#74.2)
+9V: FilterBoard.Schematic (12 pins), PSU.Schematic (C?#22.1 R?#65.2 VR?#3.3)
-9V: FilterBoard.Schematic (14 pins), PSU.Schematic (C?#25.2 R?#68.1 VR?#4.3)
GND: Display.Schematic (18 pins), FilterBoard.Schematic (32 pins), PSU.Schematic (15 pins), PIC.Schematic (7 pins), MIDI.Schematic (6N139.?4 MIDI_THRU.2)
Net6N139_?6: PIC.Schematic (U?#17.21), MIDI.Schematic (6N139.?6 MIDI_THRU.5 R?#76.2)
NetC?#1_1: FilterBoard.Schematic (C?#1.1), DAC.Schematic (C?#27.2)
NetR?#4_1: Display.Schematic (R?#4.1), PIC.Schematic (U?#17.55)
NetR?#5_1: Display.Schematic (R?#5.1), PIC.Schematic (U?#17.54)
NetR?#11_1: Display.Schematic (R?#11.1), PIC.Schematic (U?#17.53)
NetR?#12_1: Display.Schematic (R?#12.1), PIC.Schematic (U?#17.52)
NetR?#13_1: Display.Schematic (R?#13.1), PIC.Schematic (U?#17.51)
NetR?#14_1: Display.Schematic (R?#14.1), PIC.Schematic (U?#17.50)
NetR?#15_1: Display.Schematic (R?#15.1), PIC.Schematic (U?#17.49)
NetR?#16_1: Display.Schematic (R?#16.1), PIC.Schematic (U?#17.61)
NetR?#52_1: FilterBoard.Schematic (R?#52.1), PIC.Schematic (U?#17.24)